# EAGLE schematic Batteries (EAGLE 9.6.2)
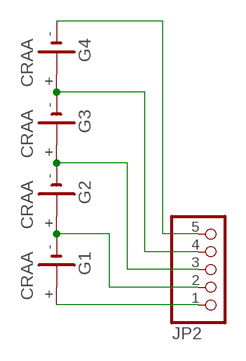
[diagram p0: schematic, sheet 1]

## Parts
G1  CRAA  [CRAA]
G2  CRAA  [CRAA]
G3  CRAA  [CRAA]
G4  CRAA  [CRAA]
JP2  PINHD-1X5  [1X05]

## Nets
N$21: G1.+ G1.- G2.+ G2.- G3.+ G3.- G4.+ JP2.1 JP2.2 JP2.3 JP2.4
N$26: G4.- JP2.5
Unconnected: G1.+@1(+) G2.+@1(+) G3.+@1(+) G4.+@1(+)

## Library data of the parts
G1-G4 = battery:CRAA: LI BATTERY Varta
JP2 = pinhead:PINHD-1X5: PIN HEADER